# Altium schematic sheet 5VSecondary.SchDoc
size A; SheetNumber: 6; SheetTotal: 15
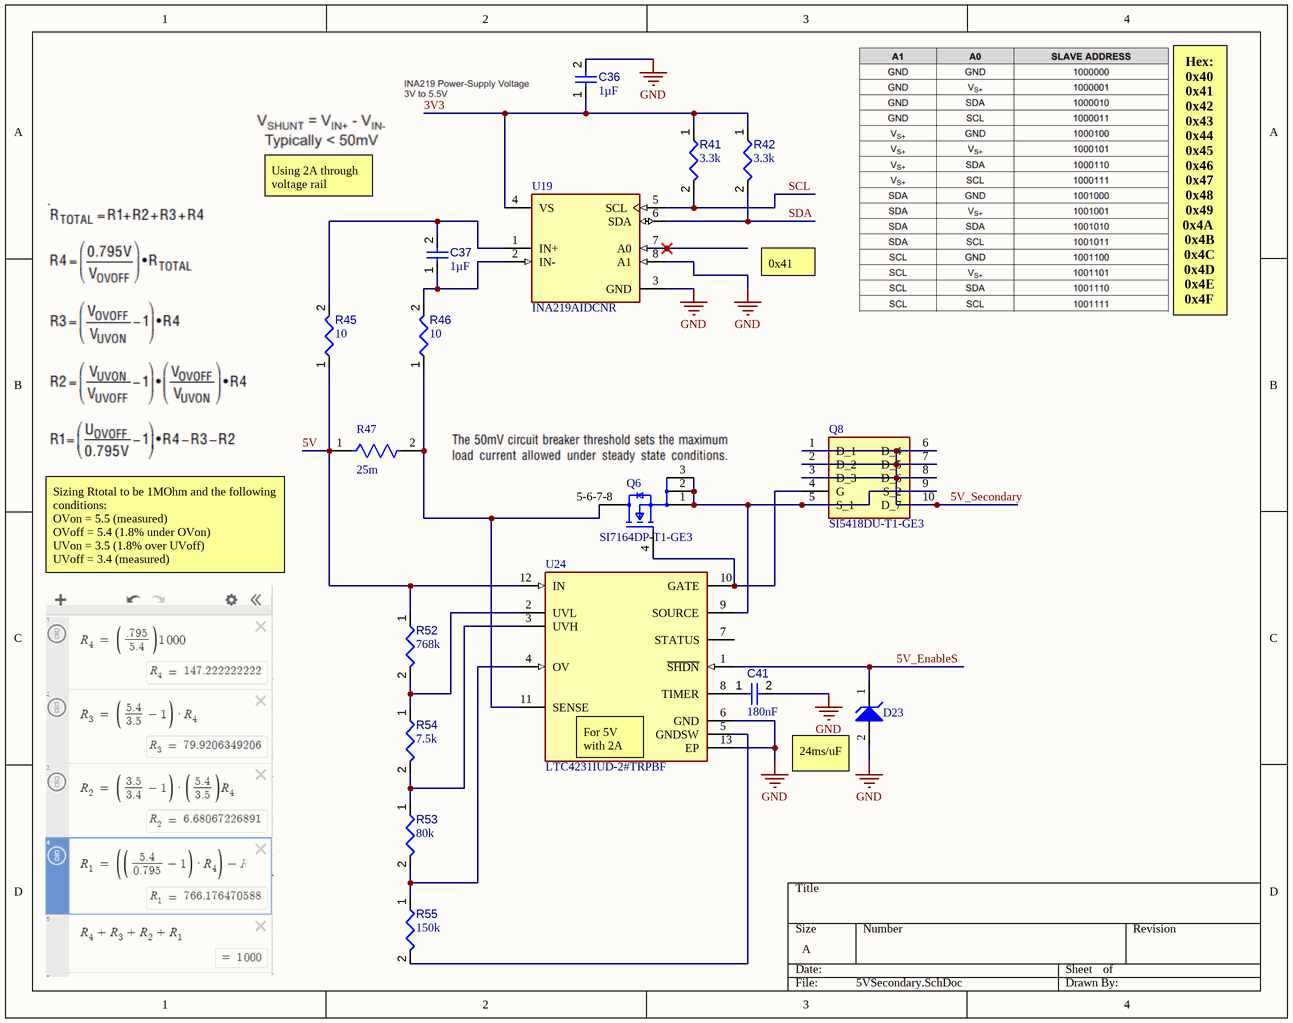
[diagram p0: 5VSecondary.SchDoc]

## Parts
C36  value 1µF  [CAPC1608X90X35ML15T15]  (hidden comment: Capacitor 1uF +/- 10% 16V 0603)
C37  value 1µF  [CAPC1608X90X40LL10T20]  (hidden comment: Capacitor 1 uF +/- 10% 25 V 0603)
C41  value 180nF  [FP-C0805C-DN-IPC_A]  (hidden comment: C0805C184K5RACTU)
D23  MM3Z3V6T1G  [ONSC-SOD-323-2-477-02_V]  (value not drawn)
Q6  SI7164DP-T1-GE3  [Vishay_S17-0173-SINGLE_MFG]
Q8  SI5418DU-T1-GE3  [SI5418DU-T1-GE3-Footprint-1]
R41  value 3.3k  [FP-CRCW1210-e3-IPC_C]  (hidden comment: CRCW12103K30JNEA)
R42  value 3.3k  [FP-CRCW1210-e3-IPC_C]  (hidden comment: CRCW12103K30JNEA)
R45  value 10  [RESC0402(1005)_L]  (hidden comment: Resistor 10R  +/-1 % 0402 63 mW)
R46  value 10  [RESC0402(1005)_L]  (hidden comment: Resistor 10R  +/-1 % 0402 63 mW)
R47  Resistance: 25m  [FP-CSR1206-IPC_C]  (hidden comment: CSR1206FK25L0)
R52  value 768k  [RESC0402(1005)_L]  (hidden comment: 768KR2F)
R53  value 80k  [FP-PTN0603-IPC_B]  (hidden comment: PTN0603E8002BST1)
R54  value 7.5k  [FP-CRCW1206-e3-IPC_A]  (hidden comment: CRCW12067K50FKEA)
R55  value 150k  [FP-RT1206-IPC_C]  (hidden comment: RT1206FRE07150KL)
U19  INA219AIDCNR  [FP-DCN0008A-IPC_A]
U24  LTC4231IUD-2#TRPBF  [FP-UD-12-05-08-1855-IPC_A]

## Nets
GND: C36.2 C41.2 D23.2(A) U19.3(GND) U19.8(A1) U24.6(GND) U24.13(EP)
3V3: C36.1 R41.1 R42.1 U19.4(VS)
5V: R45.1 R47.1 R52.1 U24.12(IN)
5V_EnableS: D23.1(K) U24.1(~{SHDN})
5V_Secondary: Q8.1(D_1) Q8.2(D_2) Q8.3(D_3) Q8.6(D_4) Q8.7(D_5) Q8.8(D_6) Q8.10(D_7)
SCL: R41.2 U19.5(SCL)
SDA: R42.2 U19.6(SDA)
NetC37_1: C37.1 R46.2 U19.2(IN-)
NetC37_2: C37.2 R45.2 U19.1(IN+)
NetC41_1: C41.1 U24.8(TIMER)
NetQ6_1: Q6.1(S) Q6.2(S) Q6.3(S) Q8.5(S_1) Q8.9(S_2) U24.9(SOURCE)
NetQ6_4: Q6.4(G) Q8.4(G) U24.10(GATE)
NetQ6_5-6-7-8: Q6.5-6-7-8(D) R46.1 R47.2 U24.11(SENSE)
NetR52_2: R52.2 R54.1 U24.2(UVL)
NetR53_1: R53.1 R54.2 U24.3(UVH)
NetR53_2: R53.2 R55.1 U24.4(OV)
NetR55_2: R55.2 U24.5(GNDSW)

Not connected (* = marked no-connect by the designer): U19 7(A0)*; U24 7(STATUS)

## Notes on the sheet
- Using 2A through voltage rail
- 0x41
- Hex:
  0x40
  0x41
  0x42
  0x43
  0x44
  0x45
  0x46
  0x47
  0x48
  0x49
  0x4A
  0x4B
  0x4C
  0x4D
  0x4E
  0x4F
- Sizing Rtotal to be 1MOhm and the following conditions:
  OVon = 5.5 (measured)
  OVoff = 5.4 (1.8% under OVon)
  UVon = 3.5 (1.8% over UVoff)
  UVoff = 3.4 (measured)
- (near U24) For 5V
  with 2A
- (near D23) 24ms/uF

## Library data of the parts
C36 = CMP-001-00004-6: Chip Capacitor, 1 uF, +/- 10%, 16 V, 0603 (1608 Metric); Capacitor Type: Ceramic; Mounting Technology: SM; RoHS Compliant: True; Min Operating Temperature: -55°C; Case/Package: 0603; Pins: 2; Voltage Rating: 16V; Max Operating Temperature: 125°C; Tolerance: 10%
C37 = CMP-001-00005-6: Chip Capacitor, 1 uF, +/- 10%, 25 V, 0603 (1608 Metric); Capacitor Type: Ceramic; Voltage Rating: 25V; Pins: 2; Mounting Technology: SM; RoHS Compliant: True; Max Operating Temperature: 125°C; Case/Package: 0603; Min Operating Temperature: -55°C; Tolerance: 10%
C41 = CMP-001-00086-1: Ceramic Capacitor, Multilayer, Ceramic, 50V, 10% +Tol, 10% -Tol, X7R, 15% TC, 0.18uF, Surface Mount, 0805; Capacitor Type: Ceramic; Mounting Technology: Surface Mount; Pins: 2; Min Operating Temperature: -55°C; Case/Package: 0805; Max Operating Temperature: 125°C; RoHS Compliant: Yes
D23 = CMP-1060-00650-1: Zener Voltage Regulator, 300 mW, 2-Pin SOD-323, Pb-Free, Tape and Reel; Manufacturer: On Semiconductor; VZ Typ (V): 3.6; P Max (W): 0.3; RoHS: Pb-Free; ComponentLink1URL: http://www.onsemi.com/; PackageVersion: Rev. H, 03/2007; PartNumber: MM3Z3V6T1G; ComponentLink2Description: Datasheet; ComponentLink2URL: http://www.onsemi.cn/pub_link/Collateral/MM3Z2V4T1-D.PDF; DatasheetVersion: Rev. 9; PackageReference: SOD-323-2-477-02; ComponentLink3URL: http://www.onsemi.com/pub_link/Collateral/477-02.PDF.1; Packing: Tape and Reel; Mounting Technology: Surface Mount; ComponentLink3Description: Package Specification; PackageDescription: 2-Pin SOD, Body 1.7 x 1.25 mm; ComponentLink1Description: Manufacturer URL
Q6 = CMP-013-00040-1: Power Field-Effect Transistor, 23.5A I(D), 60V, 0.00625ohm, 1-Element, N-Channel, Silicon, Metal-oxide Semiconductor FET; Pins: 5; RoHS Compliant: Yes; Max Operating Temperature: 150°C
Q8 = CMP-013-00041-1: Power Field-Effect Transistor, 11.6A I(D), 30V, 0.0145ohm, 1-Element, N-Channel, Silicon, Metal-oxide Semiconductor FET; Max Operating Temperature: 150°C; RoHS Compliant: Yes; Pins: 3
R41 R42 = CMP-009-00192-1: Fixed Resistor, Metal Glaze/thick Film, 0.5W, 3300ohm, 200V, 5% +/-Tol, 200ppm/Cel, Surface Mount, 1210; Power: 500mW; RoHS Compliant: Yes; Max Operating Temperature: 155°C; Case/Package: 1210; Min Operating Temperature: -55°C; Mounting Technology: Surface Mount; Tolerance: 5%; Pins: 2
R45 R46 = CMP-009-00152-3: Chip Resistor, 10 Ohms, +/-1 %, 63 mW, -55 to 155 degC, 0402; Tolerance: 1%; Power: 63mW; Pins: 2; Max Operating Temperature: 155°C; Min Operating Temperature: -55°C; Case/Package: 0402
R47 = CMP-26527-000133-1: General Purpose Thick Film Chip Resistor, 1206, 25mΩ, 1%, 0.5W; Max Power Dissipation: 500mW; Temperature Coefficient: 100ppm/°C; Lead Free: Lead Free; Military Standard: Not; Case Code (Imperial): 1206; Max Operating Temperature: 155°C; Case Code (Metric): 3216; Height: 0.026inch; Packaging: Tape and Reel; Case/Package: 1206; Series: CSR; Number of Terminations: 2; RoHS Compliant: Yes; Mount: Surface Mount; Depth: 1.55mm; Contact Plating: Tin; Length: 0.12inch; Radiation Hardening: No; Width: 0.061inch; Size Code: 1206; Power Rating: 500mW; Min Operating Temperature: -55°C; Tolerance: 1%; Resistor Type: Thick Film; Construction: Rectangular
R52 = CMP-009-00110-2: 768K 0.063W 1% 0402 (1005 Metric)  SMD; Power: 63mW; Tolerance: 1%; Mounting Technology: SMT; Pins: 2; Case/Package: 0402
R53 = CMP-009-00194-1: Fixed Resistor, Thin Film, 0.15W, 80000ohm, 75V, 0.1% +/-Tol, 25ppm/Cel, Surface Mount, 0603; Power: 150mW; Case/Package: 0603; RoHS Compliant: Yes; Pins: 2; Mounting Technology: Surface Mount; Max Operating Temperature: 150°C; Tolerance: 0.1%; Min Operating Temperature: -55°C
R54 = CMP-009-00195-1: Fixed Resistor, Metal Glaze/thick Film, 0.25W, 7500ohm, 200V, 1% +/-Tol, 100ppm/Cel, Surface Mount, 1206; Power: 250mW; RoHS Compliant: Yes; Pins: 2; Tolerance: 1%; Min Operating Temperature: -55°C; Max Operating Temperature: 155°C; Case/Package: 1206; Mounting Technology: Surface Mount
R55 = CMP-009-00193-1: Fixed Resistor, Thin Film, 0.25W, 150000ohm, 200V, 1% +/-Tol, 50ppm/Cel, Surface Mount, 1206; Power: 250mW; Pins: 2; Case/Package: 1206; Tolerance: 1%; Mounting Technology: Surface Mount; Max Operating Temperature: 155°C; RoHS Compliant: Yes; Min Operating Temperature: -55°C
U19 = CMP-010-00025-1: Power Supply Support Circuit, Fixed, 2 Channel, 2V, PDSO8; Nominal Supply Voltage: 3.3V; Max Supply Voltage: 5.5V; Min Supply Voltage: 3V; Case/Package: LSSOP; Max Operating Temperature: 125°C; Min Operating Temperature: -40°C; Pins: 8; RoHS Compliant: Yes
U24 = CMP-019-00049-1: Switching Controller, CMOS, PQCC12; Max Supply Voltage: 36V; Pins: 12; Min Operating Temperature: -40°C; Case/Package: HVQCCN; RoHS Compliant: Yes; Max Operating Temperature: 85°C